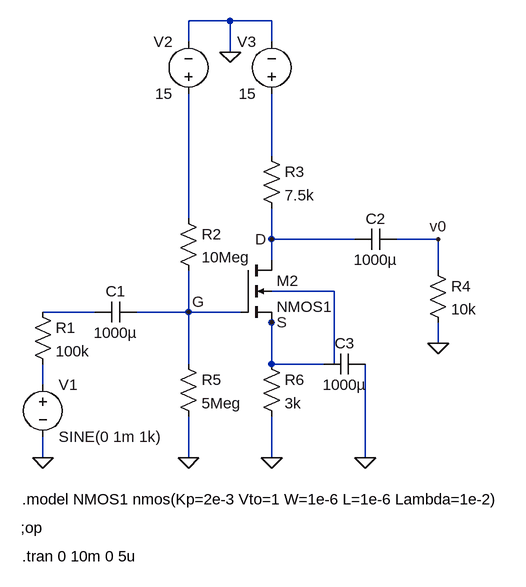
[diagram p0: schematic 42Henrique.asc]
42Henrique.asc, the LTspice schematic file:
Version 4
SHEET 1 964 680
WIRE 320 -496 256 -496
WIRE 384 -496 320 -496
WIRE 256 -464 256 -496
WIRE 384 -464 384 -496
WIRE 320 -448 320 -496
WIRE 384 -288 384 -384
WIRE 256 -192 256 -384
WIRE 384 -160 384 -208
WIRE 512 -160 384 -160
WIRE 640 -160 576 -160
WIRE 384 -128 384 -160
WIRE 640 -112 640 -160
WIRE 480 -80 384 -80
WIRE 112 -48 32 -48
WIRE 256 -48 256 -112
WIRE 256 -48 176 -48
WIRE 336 -48 256 -48
WIRE 384 -32 384 -48
WIRE 640 0 640 -32
WIRE 256 32 256 -48
WIRE 384 32 384 -32
WIRE 464 32 384 32
WIRE 480 32 480 -80
WIRE 32 64 32 32
WIRE 32 176 32 144
WIRE 256 176 256 112
WIRE 384 176 384 112
WIRE 528 176 528 32
FLAG 32 176 0
FLAG 256 176 0
FLAG 384 176 0
FLAG 528 176 0
FLAG 320 -448 0
FLAG 640 0 0
FLAG 640 -160 v0
FLAG 256 -48 G
FLAG 384 -160 D
FLAG 384 -32 S
SYMBOL voltage 32 48 R0
WINDOW 123 0 0 Left 0
WINDOW 39 0 0 Left 0
SYMATTR InstName V1
SYMATTR Value SINE(0 1m 1k)
SYMBOL res 16 -64 R0
SYMATTR InstName R1
SYMATTR Value 100k
SYMBOL res 240 -208 R0
SYMATTR InstName R2
SYMATTR Value 10Meg
SYMBOL res 368 -304 R0
SYMATTR InstName R3
SYMATTR Value 7.5k
SYMBOL res 624 -128 R0
SYMATTR InstName R4
SYMATTR Value 10k
SYMBOL res 240 16 R0
SYMATTR InstName R5
SYMATTR Value 5Meg
SYMBOL cap 176 -64 R90
WINDOW 0 0 32 VBottom 2
WINDOW 3 32 32 VTop 2
SYMATTR InstName C1
SYMATTR Value 1000µ
SYMBOL cap 576 -176 R90
WINDOW 0 0 32 VBottom 2
WINDOW 3 32 32 VTop 2
SYMATTR InstName C2
SYMATTR Value 1000µ
SYMBOL cap 528 16 R90
WINDOW 0 0 32 VBottom 2
WINDOW 3 32 32 VTop 2
SYMATTR InstName C3
SYMATTR Value 1000µ
SYMBOL res 368 16 R0
SYMATTR InstName R6
SYMATTR Value 3k
SYMBOL voltage 256 -368 R180
WINDOW 0 24 96 Left 2
WINDOW 3 24 16 Left 2
WINDOW 123 0 0 Left 0
WINDOW 39 0 0 Left 0
SYMATTR InstName V2
SYMATTR Value 15
SYMBOL voltage 384 -368 R180
WINDOW 0 24 96 Left 2
WINDOW 3 24 16 Left 2
WINDOW 123 0 0 Left 0
WINDOW 39 0 0 Left 0
SYMATTR InstName V3
SYMATTR Value 15
SYMBOL nmos4 336 -128 R0
SYMATTR InstName M2
SYMATTR Value NMOS1
TEXT 0 240 Left 2 !.model NMOS1 nmos(Kp=2e-3 Vto=1 W=1e-6 L=1e-6 Lambda=1e-2)
TEXT -2 284 Left 2 !;op
TEXT 0 328 Left 2 !.tran 0 10m 0 5u

The netlist it stands for:
* 42Henrique.asc
V1 N005 0 SINE(0 1m 1k)
R1 N004 N005 100k
R2 N002 G 10Meg
R3 N001 D 7.5k
R4 v0 0 10k
R5 G 0 5Meg
C1 G N004 1000µ
C2 v0 D 1000µ
C3 0 S 1000µ
R6 S 0 3k
V2 N002 0 15
V3 N001 0 15
M2 D G S N003 NMOS1
.model NMOS NMOS
.model PMOS PMOS
.lib standard.mos
.model NMOS1 nmos(Kp=2e-3 Vto=1 W=1e-6 L=1e-6 Lambda=1e-2)
;op
.tran 0 10m 0 5u
.backanno
.end